# Altium project FINAL_DYCDE_MODULOQ.PrjPcb
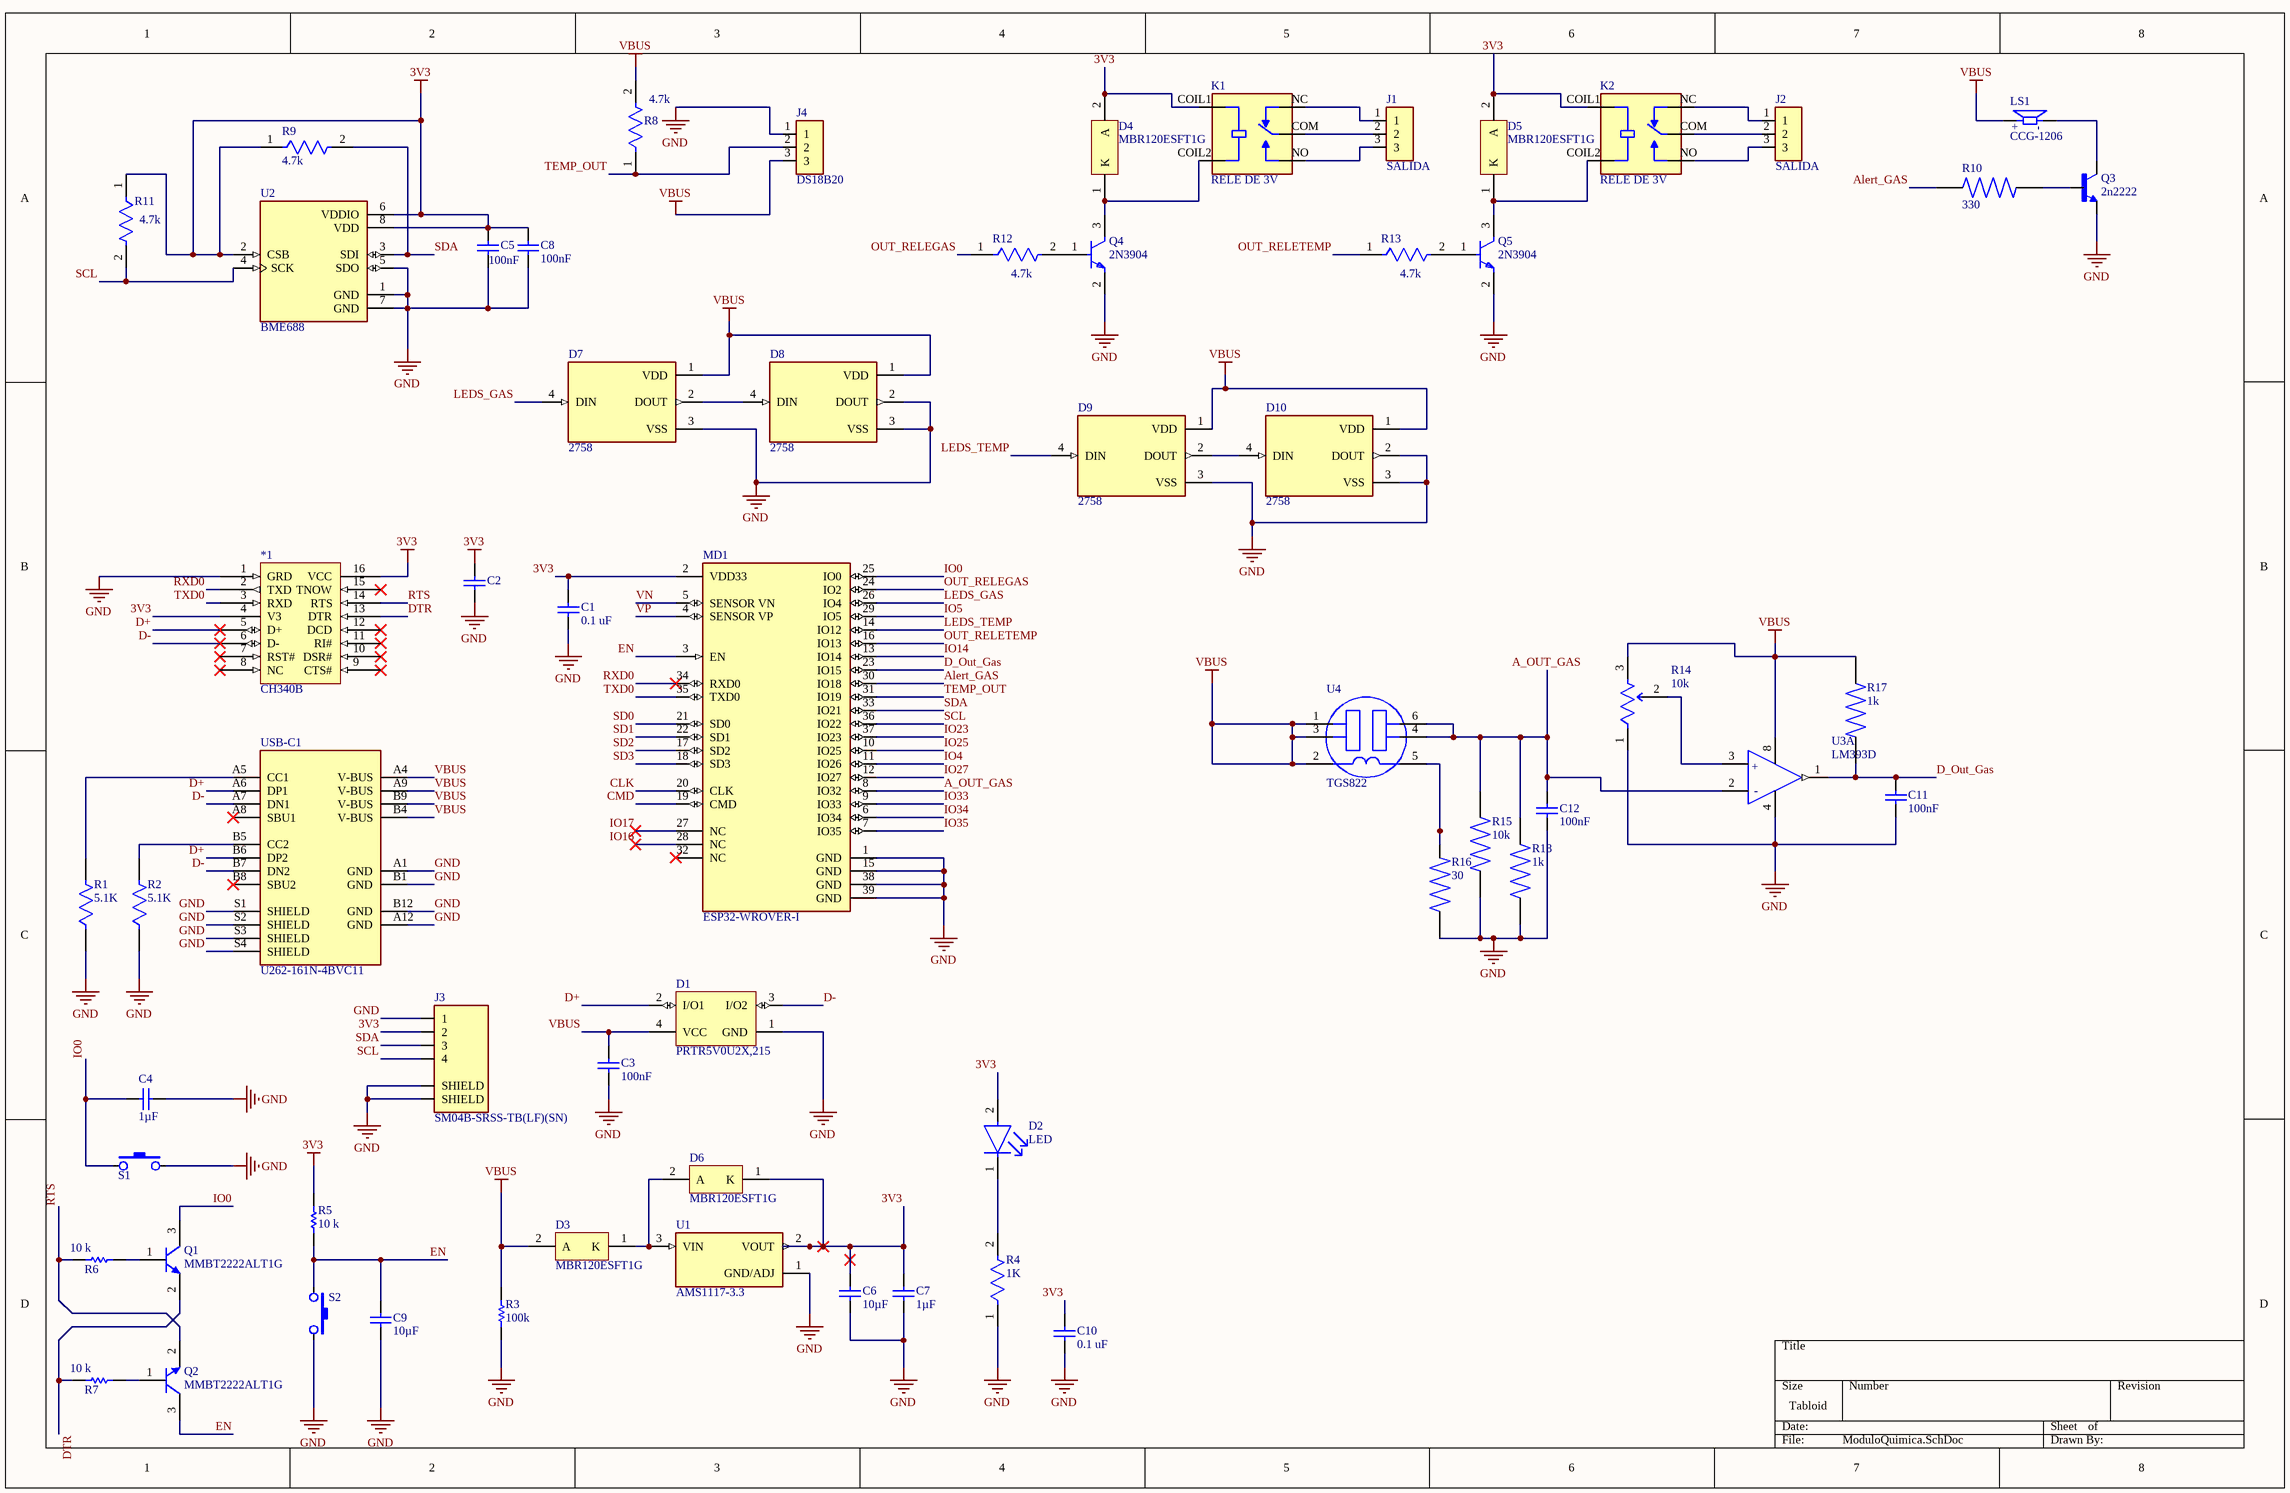
[diagram p0: ModuloQuimica.SchDoc]
1 sheet, 61 parts. Net scope: global (net labels, ports and power ports of the same name join across sheets).
Board files: Proyecto_Dycde.PcbDoc, Proyecto_Dycde.PcbDoc

## Sheet ModuloQuimica.SchDoc
size Tabloid; SheetNumber: 1; SheetTotal: 1

### Parts
*1  CH340B  [CH340B]
C1  0.1 uF  [CAPC2013X94X50ML20T25]
C2  08055C104KAT2A  [CAPC2013X94X50ML20T25]  (value not drawn)
C3  100nF  [CAPC2013X94X50ML20T25]
C4  1µF  [CAPC2013X145X50ML20T25]
C5  100nF  [CAPC2013X145X20LL20]
C6  10µF  [CAPC2013X140X50ML20T25]
C7  1µF  [CAPC2013X145X50ML20T25]
C8  100nF  [CAPC2013X145X20LL20]
C9  10µF  [CAPC2013X145X50ML20T25]
C10  0.1 uF  [CAPC2013X94X50ML20T25]
C11  100nF  [CAPC2013X145X20LL20]
C12  100nF  [CAPC2013X145X20LL20]
D1  PRTR5V0U2X,215  [NXP-SOT143B-4_V]
D2  LED  [FP-HSMG-C150-MFG]
D3  MBR120ESFT1G  [ONSC-SOD-123FL-2-498_V]
D4  MBR120ESFT1G  [ONSC-SOD-123FL-2-498_V]
D5  MBR120ESFT1G  [ONSC-SOD-123FL-2-498_V]
D6  MBR120ESFT1G  [ONSC-SOD-123FL-2-498_V]
D7  2758  [SOL320P540X170-4N]
D8  2758  [SOL320P540X170-4N]
D9  2758  [SOL320P540X170-4N]
D10  2758  [SOL320P540X170-4N]
J1  SALIDA  [TE_282836-3]
J2  SALIDA  [TE_282836-3]
J3  SM04B-SRSS-TB(LF)(SN)  [JST_SM04B-SRSS-TB(LF)(SN)]
J4  DS18B20  [TE_282836-3]
K1  RELE DE 3V  [RELAY_SRD-03VDC-SL-C]
K2  RELE DE 3V  [RELAY_SRD-03VDC-SL-C]
LS1  CCG-1206  [CUI_CCG-1206]
MD1  ESP32-WROVER-I  [FP-ESP32-WROVER-I-MFG]
Q1  MMBT2222ALT1G  [ONSC-SOT-23-3-318-08_V]
Q2  MMBT2222ALT1G  [ONSC-SOT-23-3-318-08_V]
Q3  2n2222  [SOT95P240X120-3N]
Q4  2N3904  [FP-SS8050-G-MFG]
Q5  2N3904  [FP-SS8050-G-MFG]
R1  5.1K  [FP-CRCW0805-e3-MFG]
R2  5.1K  [FP-CRCW0805-e3-MFG]
R3  100k  [RESC2013X60X40ML20T25]
R4  1K  [FP-RP732A-MFG]
R5  10 k  [RESC2013X60X30ML20T20]
R6  10 k  [RESC2013X60X30ML20T20]
R7  10 k  [RESC2013X60X30ML20T20]
R8  4.7k  [FP-CR1206-MFG]
R9  4.7k  [FP-CR1206-MFG]
R10  330  [RESC3015X65N]
R11  4.7k  [FP-CR1206-MFG]
R12  4.7k  [FP-CR1206-MFG]
R13  4.7k  [FP-CR1206-MFG]
R14  10k  [FP-3296Y-MFG]
R15  10k  [RESC3116X65N]
R16  30  [RESC2012X60N]
R17  1k  [RESC3116X65N]
R18  1k  [RESC3116X65N]
S1  IO0  [SMT_SW_PTS_820]  (value not drawn)
S2  PTS820J25MSMTRLFS  [SMT_SW_PTS_820]  (value not drawn)
U1  AMS1117-3.3  [SOT229P700X180-4N]
U2  BME688  [IC_BME688]
U3  LM393D  [FP-SO8-MFG]  (part A of 2)
U4  TGS822  [FP-TGS822-MFG]
USB-C1  U262-161N-4BVC11  [U262-161N-4BVC11]

### Nets
3V3: *1.4(V3) *1.16(VCC) C1.2 C2.2 C5.2 C6.2 C7.2 C8.2 C10.2 D2.2(A) D4.2(A) D5.2(A) D6.1(K) J3.2 K1.COIL1 K2.COIL1 MD1.2(VDD33) R5.2 R9.1 R11.1 U1.2(VOUT) U2.2(CSB) U2.6(VDDIO) U2.8(VDD)
GND: *1.1(GRD) C1.1 C2.1 C3.1 C4.1 C5.1 C6.1 C7.1 C8.1 C9.1 C10.1 C11.1 C12.1 D1.1(GND) D7.3(VSS) D8.2(DOUT) D8.3(VSS) D9.3(VSS) D10.2(DOUT) D10.3(VSS) J3.1 J3.S1(SHIELD) J3.S2(SHIELD) J4.1 MD1.1(GND) MD1.15(GND) MD1.38(GND) MD1.39(GND) Q3.2(E) Q4.2(E) Q5.2(E) R1.1 R2.1 R3.1 R4.1 R14.1(CCW) R15.1 R16.2 R18.1 S1.2 S2.2 U1.1(GND/ADJ) U2.1(GND) U2.5(SDO) U2.7(GND) U3.4(Vcc-) USB-C1.A1(GND) USB-C1.A12(GND) USB-C1.B1(GND) USB-C1.B12(GND) USB-C1.S1(SHIELD) USB-C1.S2(SHIELD) USB-C1.S3(SHIELD) USB-C1.S4(SHIELD)
VBUS: C3.2 D1.4(VCC) D3.2(A) D7.1(VDD) D8.1(VDD) D9.1(VDD) D10.1(VDD) J4.3 LS1.P R3.2 R8.2 R14.3(CW) R17.2 U3.8(Vcc+) U4.1(VC) U4.2(VH) U4.3(VC) USB-C1.A4(V-BUS) USB-C1.A9(V-BUS) USB-C1.B4(V-BUS) USB-C1.B9(V-BUS)
A_OUT_GAS: C12.2 MD1.8(IO32) R15.2 R18.2 U3.2(In1-) U4.4(VRL) U4.6(VRL)
Alert_GAS: MD1.30(IO18) R10.1
CLK: MD1.20(CLK)
CMD: MD1.19(CMD)
D+: *1.5(D+) D1.2(I/O1) USB-C1.A6(DP1) USB-C1.B6(DP2)
D-: *1.6(D-) D1.3(I/O2) USB-C1.A7(DN1) USB-C1.B7(DN2)
D_Out_Gas: C11.2 MD1.23(IO15) R17.1 U3.1(Out1)
DTR: *1.13(DTR) Q1.2(E) R7.2
EN: C9.2 MD1.3(EN) Q2.3(C) R5.1 S2.1
IO0: C4.2 MD1.25(IO0) Q1.3(C) S1.1
IO4: MD1.11(IO26)
IO5: MD1.29(IO5)
IO14: MD1.13(IO14)
IO16: MD1.28(NC)
IO17: MD1.27(NC)
IO23: MD1.37(IO23)
IO25: MD1.10(IO25)
IO27: MD1.12(IO27)
IO33: MD1.9(IO33)
IO34: MD1.6(IO34)
IO35: MD1.7(IO35)
LEDS_GAS: D7.4(DIN) MD1.26(IO4)
LEDS_TEMP: D9.4(DIN) MD1.14(IO12)
OUT_RELEGAS: MD1.24(IO2) R12.1
OUT_RELETEMP: MD1.16(IO13) R13.1
RTS: *1.14(RTS) Q2.2(E) R6.2
RXD0: *1.2(TXD) MD1.34(RXD0)
SCL: J3.4 MD1.36(IO22) R11.2 U2.4(SCK)
SD0: MD1.21(SD0)
SD1: MD1.22(SD1)
SD2: MD1.17(SD2)
SD3: MD1.18(SD3)
SDA: J3.3 MD1.33(IO21) R9.2 U2.3(SDI)
TEMP_OUT: J4.2 MD1.31(IO19) R8.1
TXD0: *1.3(RXD) MD1.35(TXD0)
VN: MD1.5(SENSOR_VN)
VP: MD1.4(SENSOR_VP)
NetD2_1: D2.1(C) R4.2
NetD3_1: D3.1(K) D6.2(A) U1.3(VIN)
NetD4_1: D4.1(K) K1.COIL2 Q4.3(C)
NetD5_1: D5.1(K) K2.COIL2 Q5.3(C)
NetD7_2: D7.2(DOUT) D8.4(DIN)
NetD9_2: D9.2(DOUT) D10.4(DIN)
NetJ1_1: J1.1 K1.NC
NetJ1_2: J1.2 K1.COM
NetJ1_3: J1.3 K1.NO
NetJ2_1: J2.1 K2.NC
NetJ2_2: J2.2 K2.COM
NetJ2_3: J2.3 K2.NO
NetLS1_M: LS1.M Q3.3(C)
NetQ1_1: Q1.1(B) R6.1
NetQ2_1: Q2.1(B) R7.1
NetQ3_1: Q3.1(B) R10.2
NetQ4_1: Q4.1(B) R12.2
NetQ5_1: Q5.1(B) R13.2
NetR1_2: R1.2 USB-C1.A5(CC1)
NetR2_2: R2.2 USB-C1.B5(CC2)
NetR14_2: R14.2(WIPER) U3.3(In1+)
NetR16_1: R16.1 U4.5(GND)

Not connected (* = marked no-connect by the designer): *1 7(RST#)* 8(NC)* 9(CTS#)* 10(DSR#)* 11(RI#)* 12(DCD)* 15(TNOW)*; MD1 32(NC)*; USB-C1 A8(SBU1)* B8(SBU2)*

### Notes on the sheet
- (in symbol CCG-1206) +; -
- (in symbol CMP-12132-000003-1, part A) +; -

### Library data of the parts
*1 = CH340B: - USB 2.0 Transceiver 2Mbps SOP-16_150mil USB ICs ROHS; ComponentLink1Description: Datasheet; ComponentLink1URL: https://www.mpja.com/download/35227cpdata.pdf
C1 C2 C10 = CMP-2000-05016-1: Chip Capacitor, Ceramic, 0.1 uF, 10%, 50 V, 0805, RoHS, Tape and Reel; Manufacturer: AVX; Rated Voltage: 50V; Capacitance: 100nF; Dielectric: X7R; Case Size/Dimension: 0805; Tolerance (%): ±10%; Datasheet URL: http://www.farnell.com/datasheets/319609.pdf; Datasheet Version: Sep-07; Manufacturer URL: http://www.avx.com/
C3 = CMP-2000-05016-1: Chip Capacitor, Ceramic, 0.1 uF, 10%, 50 V, 0805, RoHS, Tape and Reel; Manufacturer: AVX; Rated Voltage: 50V; Dielectric: X7R; Case Size/Dimension: 0805; Tolerance (%): ±10%; Capacitance: 100nF; Datasheet URL: http://www.farnell.com/datasheets/319609.pdf; Datasheet Version: Sep-07; Manufacturer URL: http://www.avx.com/
C4 C7 C9 = CMP-2007-01082-1: 1µF ±10% 16V Ceramic Capacitor X7R 0805 (2012 Metric); Manufacturer: Kemet; Part Number: C0805C105K4RAC7800
C5 C8 C11 C12 = CMP-2000-07557-1: Chip Capacitor, 0.1 uF, +/- 10%, 50 V, -55 to 125 degC, 0805 (2012 Metric), RoHS, Tape and Reel; Manufacturer: TDK; Voltage Rating: 50V; Dielectric Material: Ceramic; Dielectric: X7R; Datasheet Version: 07/2017; Max Operating Temperature: 125degC; RoHSCompliant: True; Min Operating Temperature: -55degC; Case/Package: 0805; Composition: Ceramic; Width: 0.049inch; Thickness: 0.037inch; Datasheet URL: https://product.tdk.com/info/en/catalog/datasheets/mlcc_commercial_general_en.pdf; Height: 0.85mm; Voltage Rating (DC): 50V; Voltage: 50V; Packaging: TapeandReel; Mounting Technology: SurfaceMount; Case Code (Metric): 2012; Length: 2mm; Radiation Hardening: No; Number of Pins: 2; REACH SVHC: NoSVHC; Lead Free: LeadFree; Capacitance: 100nF; Package Reference: 805; Weight: 0.000194oz; Tolerance: 10%; Package Description: 2-Pin Surface Mount Device, Body 2 x 1.25 mm; Manufacturer URL: http://www.tdk.com/; Package Quantity: 1; Case Code (Imperial): 0805; Mount: SurfaceMount; Depth: 1.25mm; Termination: SMD/SMT
C6 = CMP-2007-03242-1: 10µF ±10% 16V Ceramic Capacitor X5R 0805 (2012 Metric); Part Number: CL21A106KOQNNNG
D1 = CMP-2000-05285-1: Ultra Low Capacitance Double Rail-to-Rail ESD Protection Diode, 5.5 V, 1 pF, -40 to 85 degC, 4-Pin SOT143B, RoHS, Tape and Reel; Manufacturer: NXP Semiconductors; Capacitance Value: 16pF; Number of Elements: 1; Rad Hardened: No; Reverse Breakdown Voltage: 6V; Working Voltage (Max): 5.5V; Polarity: Uni-Directional; Configuration: Quad; Leakage Current: 0.1uA; Product Height (mm): 1mm; Suppressor Type: DiodeArrays; Product Length (mm): 3mm; Product Depth (mm): 1.4mm; ESD Protection Voltage: 8KV@ContactDisc; Package Type: SOT; Mounting: SurfaceMount; Packaging: TapeandReel; Datasheet Version: Rev. 02, 01/2008; Reverse Stand-off Voltage: 5.5V; Manufacturer URL: http://www.nxp.com/; Operating Temp Range: -40Cto85C; Operating Temperature Classification: Industrial; Working Voltage: 5.5V; Operating Temperature Min Deg. C: -40C; Datasheet URL: https://datasheet.ciiva.com/4479/prtr5v0u2x-102853-4479461.pdf; Leakage Current (Max): 0.1uA; Direction Type: Uni-Directional; Pin Count: 3+Tab; Operating Temperature Max Deg. C: 85C; Mounting Style: SurfaceMount; Package / Case: SOT
D2 = CMP-2000-05061-2: LED GREEN DIFFUSED 1206 SMD; Manufacturer Part Number: HSMG-C150; Manufacturer: Broadcom; Led Orientation: Top View; Max Junction Temp: +95°C; Peak Emmision Wavelength: 570nm; Viewing Angle: 170°; Wavelength: 572nm; Reverse Voltage: 5V; Luminous Intensity: 15mcd; Forward Voltage: 2.2V; Power Dissipation: 65mW; Forward Current: 20mA; ComponentLink2Description: Datasheet; Lead Free: Yes; Temperature Range Low: -40°C; Package: HSMG-C150; Digikey Description: LED GREEN DIFFUSED 1206 SMD; Mouser Description: LED Uni-Color Green 570nm 2-Pin Chip LED T/R; Temperature Range High: +85°C; Device Class L1: Optoelectronics; Colour: Green; Category: Diode; Device Class L3: unset; RoHS: TRUE; Height: 1.2mm; ComponentLink2URL: https://docs.broadcom.com/docs/AV02-0551EN; Device Class L2: LEDs; Automotive: No; Ipc Land Pattern Name: DIOCP320160X55; Octopart: https://octopart.com/hsmg-c150-broadcom-71131304; Temperature: -40°C to +85°C
D3-D6 = CMP-1055-00434-1: Schottky Power Rectifier, 2-Pin SOD-123, Pb-Free, Tape and Reel; Manufacturer: On Semiconductor; Configuration: Single; IFSM Max (A): 40; ComponentLink2URL: http://www.onsemi.cn/pub_link/Collateral/MBR120ESFT1-D.PDF; PackageDescription: 2-Pin SOD, Body 1.65 x 2.7 mm; RoHS: TRUE; ComponentLink1URL: http://www.onsemi.com/; PackageVersion: Rev. D, 05/2013; PartNumber: MBR120ESFT1G; PackageReference: SOD-123FL-2-498; ComponentLink2Description: Datasheet; ComponentLink1Description: Manufacturer URL; DatasheetVersion: Rev. 4; ComponentLink3Description: Package Specification; ComponentLink3URL: http://www.onsemi.com/pub_link/Collateral/498-01.PDF; Mounting Technology: Surface Mount; Packing: Tape and Reel
D7-D10 = 2758: NeoPixel RGBW LEDs w/ Integrated DriverChip - Natural White - 4500K - White Ca; MF: Adafruit Industries; Package: SMD-4 Adafruit Industries; Value: *; Check_prices: https://www.snapeda.com/parts/2758/Adafruit+Industries+LLC/view-part/?ref=eda; Purchase-URL: https://pricing.snapeda.com/search/part/2758/?ref=eda; Availability: In Stock; SnapEDA_Link: https://www.snapeda.com/parts/2758/Adafruit+Industries+LLC/view-part/?ref=snap; Price: None; MP: 2758
J1 J2 J4 = 282836-3: TERM BLOCK 3POS SIDE ENTRY 5MM; Price: None; Value: *; Package: None; Availability: Unavailable; MP: 282836-3
J3 = SM04B-SRSS-TB(LF)(SN): Connector Header Surface Mount, Right Angle 4 position 0.039 _1.00mm_; MF: JST Sales; MP: SM04B-SRSS-TB_LF__SN_; Price: None; SnapEDA_Link: https://www.snapeda.com/parts/SM04B-SRSS-TB%28LF%29%28SN%29/JST%20Sales%20America%20Inc./view-part/557466/?ref=snap; Value: *; Availability: Unavailable; Package: None
K1 K2 = SRD-03VDC-SL-C: Relays General Purpose Non Latching 3VDC SPDT 10A (250VAC) Max 5PIN; MF: Songle Relay; SnapEDA_Link: https://www.snapeda.com/parts/SRD-03VDC-SL-C/Songle+Relay/view-part/?ref=snap; Package: NON STANDARD-5 Songle Relay; Value: *; MP: SRD-03VDC-SL-C; Check_prices: https://www.snapeda.com/parts/SRD-03VDC-SL-C/Songle+Relay/view-part/?ref=eda
LS1 = CCG-1206: 12 mm, 5 V, 85 dB, Through Hole, Sealed, Magnetic Audio Transducer Buzzer; MF: Same Sky; SnapEDA_Link: https://www.snapeda.com/parts/CCG-1206/Same+Sky/view-part/?ref=snap; Package: None; Value: *; MP: CCG-1206; Check_prices: https://www.snapeda.com/parts/CCG-1206/Same+Sky/view-part/?ref=eda
MD1 = CMP-194065-000001-1: SMD MODULE, ESP32-D0WDQ6, 32MBIT; Manufacturer: Espressif; Number Of Adc Channels: 16; Min Supply Voltage: 2.3V; Interface: I2C,SPI,UART,I2S,Other; Max Frequency: 2484MHz; Nominal Supply Current: 500mA; Sensitivity: -98dBm; Max Supply Voltage: 3.6V; Number Of Gpio: 20; Data Rate: 150Mbits/s; Package: ESP32-WROVER-I; Temperature Range Low: -40°C; Temperature Range High: +85°C; Device Class L1: Integrated Circuits (ICs); Category: UNK; ComponentLink2Description: Datasheet; Device Class L2: RF Semiconductors and Devices; Automotive: No; Lead Free: Yes; Octopart: https://octopart.com/esp32-wrover-i-espressif+systems-89171349; ComponentLink2URL: https://www.espressif.com/sites/default/files/documentation/esp32-wrover_datasheet_en.pdf; Temperature: -40°C to +85°C; Height: 3.4mm; RoHS: TRUE; Digikey Description: SMD MODULE, ESP32-D0WDQ6, 32MBIT; Device Class L3: Transceivers; Manufacturer Part Number: ESP32-WROVER-I
Q1 Q2 = CMP-1048-00538-1: General Purpose Transistor, NPN Silicon, 3-Pin SOT-23, Pb-Free, Tape and Reel; Manufacturer: On Semiconductor; fT Min (MHz): 300; IC Continuous (A): 0.6; ComponentLink3URL: http://www.onsemi.cn/pub_link/Collateral/318-08.PDF; PartNumber: MMBT2222ALT1G; RoHS: TRUE; ComponentLink1URL: http://www.onsemi.com/; ComponentLink3Description: Package Specification; ComponentLink2Description: Datasheet; Mounting Technology: Surface Mount; Packing: Tape and Reel; PackageDescription: 3-Pin Small Outline Transistor, Body 2.92 x 1.3 mm, Pitch 0.95 mm; DatasheetVersion: Rev. 10; PackageReference: SOT-23-3-318-08; ComponentLink2URL: http://www.onsemi.cn/pub_link/Collateral/MMBT2222LT1-D.PDF; Polarity: NPN; PackageVersion: Rev. AP, 11/2009; ComponentLink1Description: Manufacturer URL
Q3 = MMBT2222A: BJT, SOT-23, 40V, 600mA, NPN, 0.25W, 150Â°C; MF: Diotec Semiconductor; SnapEDA_Link: https://www.snapeda.com/parts/MMBT2222A/Diotec/view-part/?ref=snap; Package: SOT-23 Diotec; Value: *; MP: MMBT2222A; Check_prices: https://www.snapeda.com/parts/MMBT2222A/Diotec/view-part/?ref=eda
Q4 Q5 = CMP-20235-000001-1: NPN TRANSISTOR 1.5A 40V SOT-23 R; Transition Frequency: 100MHz; Max Breakdown Voltage: 25V; Collector Emitter Voltage (VCEO): 400mV; Max Power Dissipation: 300mW; Max Collector Current: 1.5A; Case/Package: TO-236-3; Packaging: Tape and Reel; RoHS Compliant: Yes; Mount: Surface Mount; Collector Emitter Breakdown Voltage: 25V
R1 R2 = CMP-2001-04024-2: RES Thick Film, 5.1kΩ, 1%, 0.125W, 100ppm/°C, 0805; Power Rating: 125mW; Voltage Rating (DC): 150V; Resistance: 5.1kR; Packaging: Tape and Reel; Case Code (Metric): 2012; Contact Plating: Tin; Case Code (Imperial): 0805; Depth: 1.25mm; Tolerance: 1%; Width: 0.049inch; Temperature Coefficient: 100ppm/°C; Max Power Dissipation: 125mW; Military Standard: Not; Lead Free: Lead Free; Mount: Surface Mount; Min Operating Temperature: -55°C; Package Quantity: 10; Weight: 0.000194oz; Height: 0.45mm; Number of Terminations: 2; Max Operating Temperature: 155°C; Termination: SMD/SMT; Case/Package: 0805; Composition: Thick Film; Voltage Rating: 150V; Length: 2mm; Features: Automotive AEC-Q200; Radiation Hardening: No
R3 = CMP-2001-00583-1: 100 kOhms ±0.1% 0.125W, 1/8W Chip Resistor 0805 (2012 Metric) Automotive AEC-Q200 Thin Film; Part Number: ERA6AEB104V; Manufacturer: Panasonic
R4 = CMP-03211-002377-1: RESISTOR, 0805 80.6Ω, 0.1% 15ppm/°C; Manufacturer: TE Connectivity; Manufacturer Part Number: RP73D2A80R6BTG; Power Rating: 0.125W; Voltage Rating: 150V; ComponentLink2URL: https://www.te.com/commerce/DocumentDelivery/DDEController?Action=srchrtrv&DocNm=1773272&DocType=DS&DocLang=English; Device Class L3: Chip SMD Resistors; Automotive: No; ComponentLink2Description: Datasheet; Series: RP73; Temperature Coefficient: 15ppm/°C; Octopart: https://octopart.com/rp73d2a80r6btg-te+connectivity-42011633; octopart_url: https://octopart.com/rp73d2a80r6btg-te+connectivity-42011633; Device Class L2: Resistors; Device Class L1: Passive Components; Value: 80.6Ω; Composition: Thin Film; Lead Free: Yes; Ipc Land Pattern Name: RESC200125X55; Resistance: 80.6Ω; Package: RP732A; packaging: 250 cut tape length; Height: 0.65mm; Tolerance: 0.1%; Temperature: -55°C to 155°C; Temperature Range High: 155°C; RoHS: TRUE; Category: Res; Temperature Range Low: -55°C
R5-R7 = CMP-2001-04657-1: 10 kOhms ±5% 0.25W, 1/4W Chip Resistor 0805 (2012 Metric) Automotive AEC-Q200, Moisture Resistant Thick Film; Part Number: RK73B2ATTD103J; Manufacturer: KOA Speer
R8 R9 R11-R13 = CMP-07231-006836-1: Thick Film Chip Resistors 1206 4.7kΩ 0.25W 1% 100ppm/°C; Voltage Rating: 200V; Max Power Dissipation: 250mW; Resistance: 4.7kR; Case/Package: 1206; Number of Terminations: 2; Length: 3.2mm; Package Quantity: 5000; Case Code (Imperial): 1206; Temperature Coefficient: 100ppm/°C; Min Operating Temperature: -55°C; RoHS Compliant: Yes; Military Standard: Not; Resistance Tolerance: 1%; Width: 1.6mm; REACH SVHC: No SVHC; Thickness: 610um; Packaging: Tape and Reel; Case Code (Metric): 3216; Series: CR1206; Tolerance: 1%; Depth: 1.6mm; Height: 0.03inch; Max Operating Temperature: 155°C; Construction: Rectangular; Mount: Surface Mount; Voltage Rating (DC): 200V; Power Rating: 250mW; Radiation Hardening: No; Contact Plating: Tin; Termination: SMD/SMT; Features: Moisture Resistant; Resistor Type: Thick Film
R10 = CRCW1206330RJNEAC: 330 Ohms Â±5% 0.25W, 1/4W Chip Resistor 1206 (3216 Metric) Thick Film; MF: Vishay; SnapEDA_Link: https://www.snapeda.com/parts/CRCW1206330RJNEAC/Vishay/view-part/?ref=snap; Package: 3015 Vishay; Value: *; MP: CRCW1206330RJNEAC; Check_prices: https://www.snapeda.com/parts/CRCW1206330RJNEAC/Vishay/view-part/?ref=eda
R14 = CMP-07234-000015-2: TRIMMER 10K OHM 0.5W PC PIN TOP; Manufacturer Series: 3296; Resistance: 10kR; Actuator Orientation: Vertical; Power Rating: 500mW; Temperature Coefficient: 100ppm/°C; Resistance Tolerance: 10%; Resistance Law: Linear; Number of Turns: 25; Actuator Type: SCREW; Number of Terminals/Pins: 3; Insulation Resistance: 1GR; Military Standard: Not; REACH SVHC: No SVHC; Lead Free: Lead Free; Resistor Type: Cermet; Max Operating Temperature: 125°C; Radiation Hardening: No; Package Quantity: 50; Mount: Panel; Max Power Dissipation: 500mW; Min Operating Temperature: -55°C; Type: Potentiometer; Terminal Finish: Tin; Termination: Pin; Taper: Linear; Color: Blue; Technology: CERMET; Packaging: Rail/Tube; Weight: 0.03oz; Height: 0.395inch; Number of Pins: 3; RoHS Compliant: Yes; Width: 9.53mm; Tolerance: 10%; Depth: 4.83mm; Series: 3296; Length: 9.53mm
R15 R17 R18 = RC1206FR-0710RL: 10 Ohms Â±1% 0.25W, 1/4W Chip Resistor 1206 (3216 Metric) Moisture Resistant Thick Film; MF: Yageo; Price: None; Availability: In Stock; MP: RC1206FR-0710RL; Package: 3116 Yageo; SnapEDA_Link: https://www.snapeda.com/parts/RC1206FR-0710RL/Yageo/view-part/?ref=snap; Check_prices: https://www.snapeda.com/parts/RC1206FR-0710RL/Yageo/view-part/?ref=eda; Value: *; Purchase-URL: https://pricing.snapeda.com/search/part/RC1206FR-0710RL/?ref=eda
R16 = RC0805FR-0710RL: Res Thick Film 0805 10 Ohm 1% 1/8W ï¿½200ppm/ï¿½C Molded SMD Paper T/R; MF: {'manufacturer': u'YAGEO'}; Package: None; Price: None; Value: *; MP: RC0805FR-0710RL; Availability: Unavailable
S1 = PTS820J25MSMTRLFS
U1 = AMS1117-3.3: Sot223/Pkg 1-Amp 3.3-Volt Low Drop Out Voltage Regulatator; MF: Advanced Monolithic Systems; SnapEDA_Link: https://www.snapeda.com/parts/AMS1117-3.3/Advanced+Monolithic+Systems/view-part/?ref=snap; Package: SOT-223 Seeed Technology; Value: *; MP: AMS1117-3.3; Check_prices: https://www.snapeda.com/parts/AMS1117-3.3/Advanced+Monolithic+Systems/view-part/?ref=eda
U2 = BME688: Gas sensor measuring relative humidity, barometric pressure, ambient temperature and gas (VOC); Package: None; MP: BME688; Price: None; Availability: Unavailable; Value: *
U3 = CMP-12132-000003-1: IC VOLT COMPARATOR DUAL LP 8SOIC; Manufacturer: STMicroelectronics; Response Time: 1.3us; Min Supply Voltage: 2V; Input Offset Voltage: 1mV; Input Bias Current: 0.02uA; Max Dual Supply Voltage: 18V; Output Current Per Channel: 18mA; Max Junction Temp: +150°C; Standoff Height: 0.1mm; Number Of Channels: 2; Nominal Supply Current: 0.45-0.6mA; Voltage Gain: 200V/mV; Max Supply Voltage: 36V; Min Dual Supply Voltage: 1V; Ambient Temperature Range Low: 0°C; ComponentLink2Description: Datasheet; Lead Free: Yes; Device Class L3: Comparators; Device Class L2: Linear ICs; Manufacturer Part Number: LM393D; Digikey Description: IC VOLT COMPARATOR DUAL LP 8SOIC; Category: IC; Octopart: https://octopart.com/lm393d-stmicroelectronics-25832; Package: SO8; RoHS: TRUE; Footprint Url: https://www.st.com/resource/en/datasheet/stm8l001j3.pdf; Temperature Range Low: 0°C; Temperature Range High: +70°C; Mouser Description: Analog Comparators Lo-Pwr Dual Voltage; ComponentLink2URL: https://www.st.com/resource/en/datasheet/lm393.pdf; Automotive: No; Temperature: 0°C to +70°C; Height: 1.75mm; Device Class L1: Integrated Circuits (ICs); Ambient Temperature Range High: +70°C
U4 = CMP-04312-24208239-1: TGS822 MOS-Type organic solvent vapors sensor; range: 50-5000ppm C2H5OH; supply: 5V; power: 660mW; Max Supply Voltage: 24V; NexarPartId: 24208239; Height: 10mm; RoHS: Compliant; Case/Package: Radial
USB-C1 = U262-161N-4BVC11: USB - Type C Female 16 SMT USB Connectors RoHS; ComponentLink1Description: datasheet; ComponentLink1URL: https://datasheet.lcsc.com/szlcsc/2002271811_XKB-Connectivity-U262-161N-4BVC11_C319148.pdf; ComponentLink2Description: LCSC Link; ComponentLink2URL: https://lcsc.com/product-detail/USB-Connectors_XKB-Connectivity-U262-161N-4BVC11_C319148.html